# Altium project Pollux III.PrjPcb (part 2 of 2)

## Sheet Audio.SchDoc
size A4; SheetNumber: 15; SheetTotal: 15
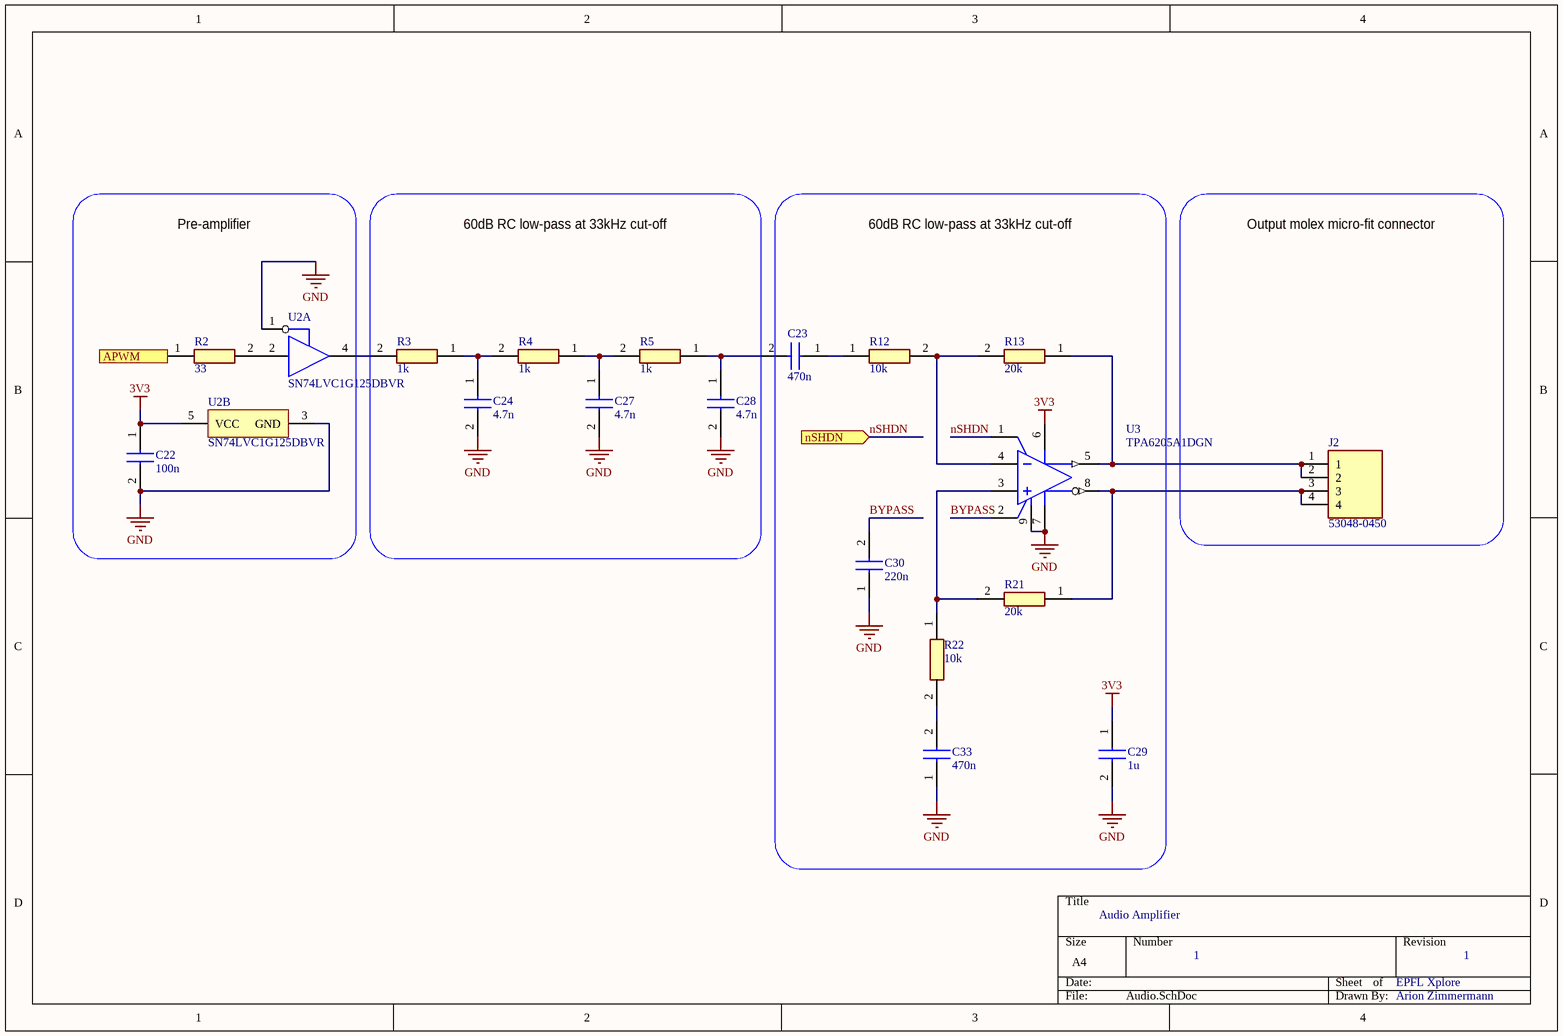
[diagram p14: Audio.SchDoc]

### Parts
C22  value 100n  [CAPC1608X95N]  (hidden comment: C0603C104K5RACTU)
C23  value 470n  [CAPC1608X95N]  (hidden comment: C0603C474K4PACTU)
C24  value 4.7n  [CAPC1608X95N]  (hidden comment: C0603C472J5RACTU)
C27  value 4.7n  [CAPC1608X95N]  (hidden comment: C0603C472J5RACTU)
C28  value 4.7n  [CAPC1608X95N]  (hidden comment: C0603C472J5RACTU)
C29  value 1u  [CAPC1608X95N]  (hidden comment: C0603C105K4RACTU)
C30  value 220n  [CAPC1608X95N]  (hidden comment: C0603C224K8RAC7411)
C33  value 470n  [CAPC1608X95N]  (hidden comment: C0603C474K4PACTU)
J2  53048-0450  [SHDRRA4W35P0X125_1X4_675X550X350P]
R2  value 33  [RESC1608X50N]  (hidden comment: CRCW060333R0JNEAC)
R3  value 1k  [RESC1608X50N]  (hidden comment: CRCW06031K00FKECC)
R4  value 1k  [RESC1608X50N]  (hidden comment: CRCW06031K00FKECC)
R5  value 1k  [RESC1608X50N]  (hidden comment: CRCW06031K00FKECC)
R12  value 10k  [RESC1608X50N]  (hidden comment: CRCW060310K2FKEA)
R13  value 20k  [RESC1608X50N]  (hidden comment: CRCW060320K0FKEAC)
R21  value 20k  [RESC1608X50N]  (hidden comment: CRCW060320K0FKEAC)
R22  value 10k  [RESC1608X50N]  (hidden comment: CRCW060310K2FKEA)
U2  SN74LVC1G125DBVR  [DBV0005A_M]  (parts A,B of 2)
U3  TPA6205A1DGN  [DGN0008D_N]

### Ports
APWM (in), nSHDN (in)

### Nets
3V3: C22.1 C29.1 U2.5(VCC) U3.6(VDD)
GND: C22.2 C24.2 C27.2 C28.2 C29.2 C30.1 C33.1 U2.1(~{OE}) U2.3(GND) U3.7(GND) U3.9(EP)
APWM: R2.1 ; port APWM
BYPASS: C30.2 U3.2(BYPASS)
nSHDN: U3.1(~{SHUTDOWN}) ; port nSHDN
NetC23_1: C23.1 R12.1
NetC23_2: C23.2 C28.1 R5.1
NetC24_1: C24.1 R3.1 R4.2
NetC27_1: C27.1 R4.1 R5.2
NetC33_2: C33.2 R22.2
NetJ2_1: J2.1 J2.2 R13.1 U3.5(VO+)
NetJ2_3: J2.3 J2.4 R21.1 U3.8(VO-)
NetR2_2: R2.2 U2.2(A)
NetR3_2: R3.2 U2.4(Y)
NetR12_2: R12.2 R13.2 U3.4(IN-)
NetR21_2: R21.2 R22.1 U3.3(IN+)

### Notes on the sheet
- Pre-amplifier
- 60dB RC low-pass at 33kHz cut-off
- Output molex micro-fit connector
- Audio Amplifier
- 1
- EPFL Xplore
- Arion Zimmermann

### Library data of the parts
C22-C24 C27-C30 C33 = C0603C104K5RACTU: Capacitor; Manufacturer_Name: Kemet; Datasheet Link: http://www.farnell.com/datasheets/2205446.pdf; Height: 0.95mm; Manufacturer_Part_Number: C0603C104K5RACTU; Mouser Part Number: 80-C0603C104K5R; Mouser Price/Stock: https://www.mouser.co.uk/ProductDetail/KEMET/C0603C104K5RACTU?qs=l5k%252BbMnNDkkVcnZPSAaaiQ%3D%3D; Arrow Part Number: C0603C104K5RACTU; Arrow Price/Stock: https://www.arrow.com/en/products/c0603c104k5ractu/kemet-corporation; Supplier 1: Mouser; Supplier Part Number 1: 80-C0603C104K5R
J2 = 53048-0450: Connector; Manufacturer_Name: Molex; Datasheet Link: https://www.molex.com/pdm_docs/sd/530480450_sd.pdf; Height: 3.5mm; Manufacturer_Part_Number: 53048-0450; Mouser Part Number: 538-53048-0450; Mouser Price/Stock: https://www.mouser.co.uk/ProductDetail/Molex/53048-0450?qs=0lSvoLzn4L%252Bhzo05ywM78Q%3D%3D
R2-R5 R12 R13 R21 R22 = CRCW0603931RFKEA: Resistor; Manufacturer_Name: Vishay; Manufacturer_Part_Number: CRCW0603787RFKEA; Datasheet Link: http://www.vishay.com/docs/20035/dcrcwe3.pdf; Height: 0.5mm; Supplier 1: Mouser; Supplier Part Number 1: 71-CRCW06032K00JNEB
U2 = CMP-0859-00019-3: Single Bus Buffer Gate With 3-State Outputs, DBV0005A, LARGE T&R; Manufacturer: Texas Instruments; VCC(Min)(V): 1.65; Sub-Family: Non-Inverting Buffer/Driver; tpd @ Nom Voltage(Max)(ns): 9,5.5,4.5,4; Input Type: CMOS/TTL; ICC @ Nom Voltage(Max)(mA): 0.01; Schmitt Trigger: No; Voltage(Nom)(V): 1.8,2.5,3.3,5; F @ Nom Voltage(Max)(Mhz): 150; Output Drive (IOL/IOH)(Max)(mA): 32/-32; 3-State Output: Yes; Output Type: CMOS; Bits(#): 1; Rating: Catalog; Technology Family: LVC; Logic: True; VCC(Max)(V): 5.5; PackageReference: DBV0005A; DatasheetVersion: SCES223T; Generic Part Number: SN74LVC1G125; Operating Temperature Range(C): -40 to 125,-40 to 85
U3 = CMP-0991-00073-2: 1.25-W Mono, Fully Differential, Class-AB Audio Amplifier with 1.8 V Compatible Shutdown Voltage, -40 to 85 degC, 8-pin SOP (DGN8), Green (RoHS & no Sb/Br); Manufacturer: Texas Instruments; PSRR(dB): -90; Output Power(W): 1.25; Supply Min(Min)(Volt): 2.5; SubFamily: Dynamic Speaker; Supply Max(Max)(Volt): 5.5; DatasheetVersion: SLOS490B; ComponentLink2Description: Datasheet; ComponentLink1Description: Manufacturer URL; ComponentLink3URL: http://www.ti.com/litv/pdf/mpds046e; Eco-Plan: Green (RoHS & no Sb/Br); Speaker Amp Type: Class-AB; Code_JEDEC: MO-187; ComponentLink1URL: http://www.ti.com/; PackageVersion: 4073271/F, 05/2011; Speaker Channels: Mono; PartNumber: TPA6205A1DGN; PackageDescription: 8-Pin Plastic Small Outline, Body 3 x 3 mm, Pitch 0.65 mm; Mounting Technology: Surface Mount; ComponentLink3Description: Package Specification; ComponentLink2URL: http://www.ti.com/general/docs/lit/getliterature.tsp?genericPartNumber=TPA6205A1&fileType=pdf; PackageReference: DGN0008D

## Nets that join several sheets
3V3: LV (J13_LV.S17), HV (J13_HV.S17), ControlUnit (5 pins), Controller (20 pins), Flash (C19.1 IC2.2), CAN (C21.1 IC5.3), IMU (7 pins), DIV2 (R9_DIV2.1), AFE6 (C26_AFE6.2 IC4_AFE6.6), AuxiliaryPowerSupply (C32.1 PS1.A5 PS1.B5 PS1.C5), Interconnect (8 pins), Interconnect/LED_ST_R (R20_LED_ST_R.1), Interconnect/LED_ST_G (R20_LED_ST_G.1), Interconnect/LED_ST_B (R20_LED_ST_B.1), AFE5 (C26_AFE5.2 IC4_AFE5.6), AFE4 (C26_AFE4.2 IC4_AFE4.6), AFE3 (C26_AFE3.2 IC4_AFE3.6), AFE2 (C26_AFE2.2 IC4_AFE2.6), AFE1 (C26_AFE1.2 IC4_AFE1.6), Audio (C22.1 C29.1 U2.5 U3.6)
+5: AuxiliaryPowerSupply (C17.1 PS2.A5 PS2.B5 PS2.C5), Display (J14.26 J14.27)
GND: TopLevel (7 pins), LV (J13_LV.P2 J13_LV.S20), HV (J13_HV.P2 J13_HV.S20), ControlUnit (C25.2 IC3.4 IC3.5 IC3.8), Controller (31 pins), Flash (C19.2 IC2.10), CAN (C21.2 IC5.2), IMU (C34.2 C35.2 C36.2 IC1.6), DIV1 (R10_DIV1.2), DIV2 (R10_DIV2.2), AFE6 (C26_AFE6.1 IC4_AFE6.7), PWR1A1 (J12_PWR1A1.2), PWR1A2 (J12_PWR1A2.2), PWR1B1 (J12_PWR1B1.2), PWR1B2 (J12_PWR1B2.2), PWR2A1 (J12_PWR2A1.2), PWR2A2 (J12_PWR2A2.2), PWR2B1 (J12_PWR2B1.2), PWR2B2 (J12_PWR2B2.2), AuxiliaryPowerSupply (40 pins), Interconnect (6 pins), Interconnect/LED_ST_R (Q5_LED_ST_R.2), Interconnect/LED_ST_G (Q5_LED_ST_G.2), Interconnect/LED_ST_B (Q5_LED_ST_B.2), AFE5 (C26_AFE5.1 IC4_AFE5.7), AFE4 (C26_AFE4.1 IC4_AFE4.7), AFE3 (C26_AFE3.1 IC4_AFE3.7), AFE2 (C26_AFE2.1 IC4_AFE2.7), AFE1 (C26_AFE1.1 IC4_AFE1.7), Display (11 pins), Audio (11 pins)
A1_C: LV (J13_LV.S21), Controller (U1.54)
A1_S: LV (J13_LV.S23), Controller (U1.52)
A2_C: HV (J13_HV.S21), Controller (U1.4)
A2_S: HV (J13_HV.S23), Controller (U1.2)
APWM: Display (J14.10), Audio (R2.1)
B1_C: LV (J13_LV.S22), Controller (U1.53)
B1_S: LV (J13_LV.S24), Controller (U1.51)
B2_C: HV (J13_HV.S22), Controller (U1.3)
B2_S: HV (J13_HV.S24), Controller (U1.1)
CAN_RX: Controller (U1.70), CAN (IC5.4)
CAN_TX: Controller (U1.71), CAN (IC5.1)
CANH: TopLevel (J5.4 J6.4), CAN (IC5.7)
CANL: TopLevel (J5.1 J6.1), CAN (IC5.6)
CS1: ControlUnit (IC3.15), AFE6 (IC4_AFE6.1)
CS2: ControlUnit (IC3.14), AFE5 (IC4_AFE5.1)
CS3: ControlUnit (IC3.13), AFE4 (IC4_AFE4.1)
CS4: ControlUnit (IC3.12), AFE3 (IC4_AFE3.1)
CS5: ControlUnit (IC3.11), AFE2 (IC4_AFE2.1)
CS6: ControlUnit (IC3.10), AFE1 (IC4_AFE1.1)
DCS: Controller (U1.41), Display (J14.4)
DINT: Controller (U1.45), Display (J14.3)
DMISO: Controller (U1.43), Display (J14.7)
DMOSI: Controller (U1.44), Display (J14.6)
DSCK: Controller (U1.42), Display (J14.8)
FSYNC: Controller (U1.55), IMU (IC1.7)
HVA: HV (J13_HV.P4), AFE4 (IC4_AFE4.10 R11_AFE4.1)
HVB: HV (J13_HV.P1), AFE3 (IC4_AFE3.10 R11_AFE3.1)
LVA: LV (J13_LV.P4), AFE6 (IC4_AFE6.10 R11_AFE6.1)
LVB: LV (J13_LV.P1), AFE5 (IC4_AFE5.10 R11_AFE5.1)
MISO: Controller (U1.30), AFE6 (IC4_AFE6.4), AFE5 (IC4_AFE5.4), AFE4 (IC4_AFE4.4), AFE3 (IC4_AFE3.4), AFE2 (IC4_AFE2.4), AFE1 (IC4_AFE1.4)
MOSI: Controller (U1.31), AFE6 (IC4_AFE6.2), AFE5 (IC4_AFE5.2), AFE4 (IC4_AFE4.2), AFE3 (IC4_AFE3.2), AFE2 (IC4_AFE2.2), AFE1 (IC4_AFE1.2)
NetJ10_18: Interconnect (J10.18), Interconnect/LED_ST_G (Q5_LED_ST_G.1 R20_LED_ST_G.2)
NetJ10_20: Interconnect (J10.20), Interconnect/LED_ST_R (Q5_LED_ST_R.1 R20_LED_ST_R.2)
NetJ10_22: Interconnect (J10.22), Interconnect/LED_ST_B (Q5_LED_ST_B.1 R20_LED_ST_B.2)
NetQ5_LED_ST_B_3: Interconnect (R18.1), Interconnect/LED_ST_B (Q5_LED_ST_B.3)
NetQ5_LED_ST_G_3: Interconnect (R17.1), Interconnect/LED_ST_G (Q5_LED_ST_G.3)
NetQ5_LED_ST_R_3: Interconnect (R16.1), Interconnect/LED_ST_R (Q5_LED_ST_R.3)
NetR9_DIV1_2: Controller (U1.17), DIV1 (R9_DIV1.2 R10_DIV1.1)
NetR9_DIV2_2: Controller (U1.18), DIV2 (R9_DIV2.2 R10_DIV2.1)
NRST: Controller (C14.1 S2.3 S2.4 U1.14), Flash (IC2.3), Display (J14.2)
nSHDN: Display (R14.2 R15.2), Audio (U3.1)
OHVA: PWR2A1 (J12_PWR2A1.1), PWR2A2 (J12_PWR2A2.1), AFE4 (IC4_AFE4.8 IC4_AFE4.9 R11_AFE4.2)
OHVB: PWR2B1 (J12_PWR2B1.1), PWR2B2 (J12_PWR2B2.1), AFE3 (IC4_AFE3.8 IC4_AFE3.9 R11_AFE3.2)
OLVA: AFE6 (IC4_AFE6.8 IC4_AFE6.9 R11_AFE6.2), PWR1A1 (J12_PWR1A1.1), PWR1A2 (J12_PWR1A2.1)
OLVB: PWR1B1 (J12_PWR1B1.1), PWR1B2 (J12_PWR1B2.1), AFE5 (IC4_AFE5.8 IC4_AFE5.9 R11_AFE5.2)
QSPI0: Controller (U1.37), Flash (IC2.15)
QSPI1: Controller (U1.38), Flash (IC2.8)
QSPI2: Controller (U1.39), Flash (IC2.9)
QSPI3: Controller (U1.40), Flash (IC2.1)
QSPICK: Controller (U1.36), Flash (IC2.16)
QSPICS: Controller (U1.79), Flash (IC2.7)
SCK: Controller (U1.29), AFE6 (IC4_AFE6.5), AFE5 (IC4_AFE5.5), AFE4 (IC4_AFE4.5), AFE3 (IC4_AFE3.5), AFE2 (IC4_AFE2.5), AFE1 (IC4_AFE1.5)
SCL: LV (J13_LV.S19), HV (J13_HV.S19), ControlUnit (R7.2), Controller (U1.92), IMU (IC1.13), Interconnect (J10.39)
SDA: LV (J13_LV.S18), HV (J13_HV.S18), ControlUnit (R8.2), Controller (U1.93), IMU (IC1.14), Interconnect (J10.37)
SPI_A0: ControlUnit (IC3.1), Controller (U1.25)
SPI_A1: ControlUnit (IC3.2), Controller (U1.24)
SPI_A2: ControlUnit (IC3.3), Controller (U1.23)
V_BAT: TopLevel (D1.1 J1.1), AFE1 (IC4_AFE1.10 R11_AFE1.1)
V_IN: LV (F1_LV.1), HV (F1_HV.1), DIV1 (R9_DIV1.1), AuxiliaryPowerSupply (6 pins), AFE2 (IC4_AFE2.10 R11_AFE2.1), AFE1 (IC4_AFE1.8 IC4_AFE1.9 R11_AFE1.2)
V_OUT: TopLevel (J3.1), AFE2 (IC4_AFE2.8 IC4_AFE2.9 R11_AFE2.2)